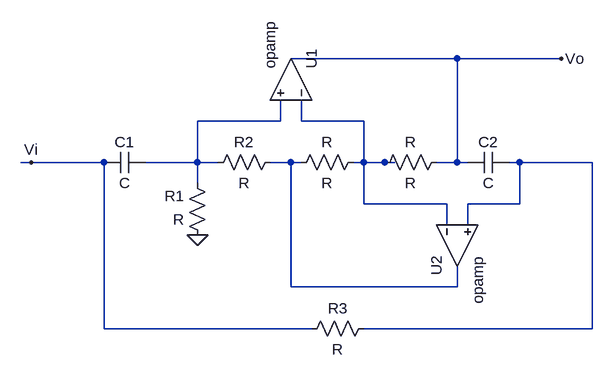
[diagram p0: schematic bicuad.asc]
bicuad.asc, the LTspice schematic file:
Version 4
SHEET 1 880 680
WIRE 544 -32 288 -32
WIRE 704 -32 544 -32
WIRE 272 64 272 32
WIRE 272 64 144 64
WIRE 304 64 304 32
WIRE 400 64 304 64
WIRE -112 128 -128 128
WIRE 0 128 -112 128
WIRE 144 128 144 64
WIRE 144 128 64 128
WIRE 176 128 144 128
WIRE 288 128 256 128
WIRE 304 128 288 128
WIRE 400 128 400 64
WIRE 400 128 384 128
WIRE 432 128 400 128
WIRE 448 128 432 128
WIRE 544 128 544 -32
WIRE 544 128 512 128
WIRE 560 128 544 128
WIRE 640 128 624 128
WIRE 752 128 640 128
WIRE 144 160 144 128
WIRE 400 192 400 128
WIRE 528 192 400 192
WIRE 640 192 640 128
WIRE 640 192 560 192
WIRE 528 224 528 192
WIRE 560 224 560 192
WIRE 288 320 288 128
WIRE 544 320 544 288
WIRE 544 320 288 320
WIRE 0 384 0 128
WIRE 320 384 0 384
WIRE 752 384 752 128
WIRE 752 384 400 384
FLAG 144 240 0
FLAG 704 -32 Vo
FLAG -112 128 Vi
SYMBOL cap 64 112 R90
WINDOW 0 0 32 VBottom 2
WINDOW 3 32 32 VTop 2
SYMATTR InstName C1
SYMBOL res 160 256 R180
WINDOW 0 36 76 Left 2
WINDOW 3 36 40 Left 2
SYMATTR InstName R1
SYMBOL res 272 112 R90
WINDOW 0 0 56 VBottom 2
WINDOW 3 32 56 VTop 2
SYMATTR InstName R2
SYMBOL res 400 112 R90
WINDOW 0 0 56 VBottom 2
WINDOW 3 32 56 VTop 2
SYMATTR InstName R
SYMBOL res 528 112 R90
WINDOW 0 0 56 VBottom 2
WINDOW 3 32 56 VTop 2
SYMATTR InstName R
SYMBOL cap 624 112 R90
WINDOW 0 0 32 VBottom 2
WINDOW 3 32 32 VTop 2
SYMATTR InstName C2
SYMBOL OpAmps\\opamp 352 0 M270
SYMATTR InstName U1
SYMBOL OpAmps\\opamp 480 256 M90
SYMATTR InstName U2
SYMBOL res 416 368 R90
WINDOW 0 0 56 VBottom 2
WINDOW 3 32 56 VTop 2
SYMATTR InstName R3

The netlist it stands for:
* bicuad.asc
C1 N001 Vi C
R1 0 N001 R
R2 N003 N001 R
R N002 N003 R
R Vo N002 R
C2 N004 Vo C
XU1 N002 N001 Vo opamp Aol=100K GBW=10Meg  ; pins invin noninvin out
XU2 N002 N004 N003 opamp Aol=100K GBW=10Meg  ; pins invin noninvin out
R3 N004 Vi R
.backanno
.end